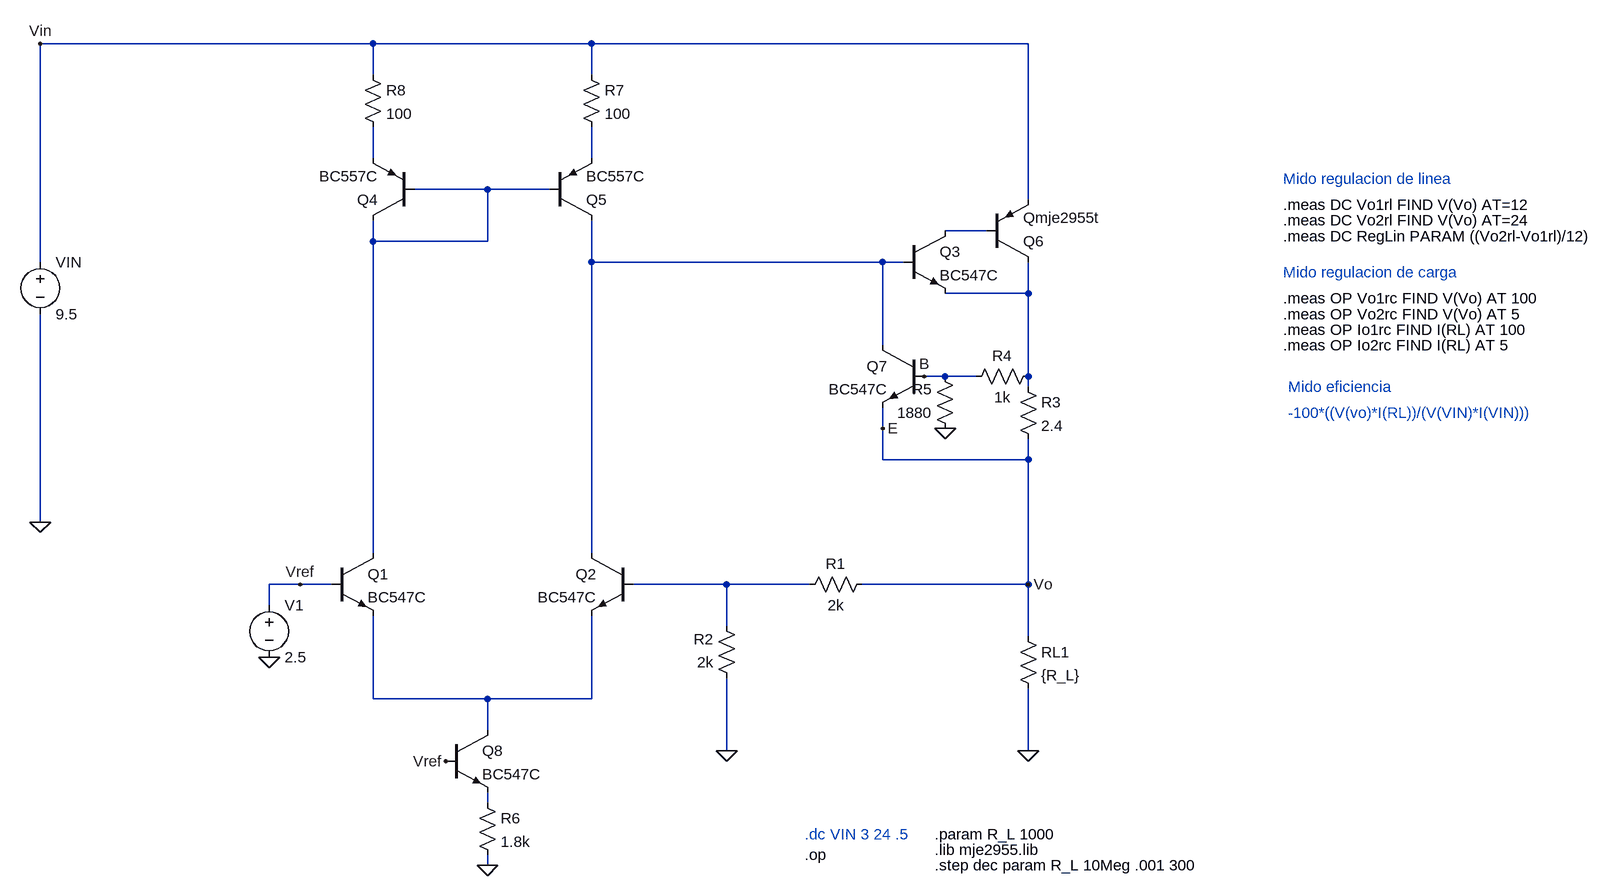
[diagram p0: schematic Draft3.asc]
Draft3.asc, the LTspice schematic file:
Version 4.1
SHEET 1 1356 680
WIRE -560 -688 -1072 -688
WIRE -224 -688 -560 -688
WIRE 448 -688 -224 -688
WIRE -560 -640 -560 -688
WIRE -224 -640 -224 -688
WIRE -560 -512 -560 -560
WIRE -224 -512 -224 -560
WIRE -384 -464 -496 -464
WIRE -288 -464 -384 -464
WIRE 448 -448 448 -688
WIRE 384 -400 320 -400
WIRE -560 -384 -560 -416
WIRE -384 -384 -384 -464
WIRE -384 -384 -560 -384
WIRE -1072 -352 -1072 -688
WIRE -224 -352 -224 -416
WIRE 224 -352 -224 -352
WIRE 256 -352 224 -352
WIRE 448 -304 448 -352
WIRE 448 -304 320 -304
WIRE 224 -224 224 -352
WIRE 320 -176 288 -176
WIRE 368 -176 320 -176
WIRE 448 -176 448 -304
WIRE 448 -160 448 -176
WIRE 224 -96 224 -128
WIRE 224 -48 224 -96
WIRE 448 -48 448 -80
WIRE 448 -48 224 -48
WIRE -1072 48 -1072 -272
WIRE -560 96 -560 -384
WIRE -224 96 -224 -352
WIRE -672 144 -720 144
WIRE -624 144 -672 144
WIRE -16 144 -160 144
WIRE 112 144 -16 144
WIRE 448 144 448 -48
WIRE 448 144 192 144
WIRE -720 176 -720 144
WIRE -16 208 -16 144
WIRE 448 224 448 144
WIRE -560 320 -560 192
WIRE -384 320 -560 320
WIRE -224 320 -224 192
WIRE -224 320 -384 320
WIRE -384 368 -384 320
WIRE -16 400 -16 288
WIRE 448 400 448 304
WIRE -384 480 -384 464
WIRE -384 576 -384 560
FLAG -720 256 0
FLAG 448 400 0
FLAG -1072 48 0
FLAG -16 400 0
FLAG 448 144 Vo
FLAG 320 -96 0
FLAG 288 -176 B
FLAG 224 -96 E
FLAG -672 144 Vref
FLAG -448 416 Vref
FLAG -384 576 0
FLAG -1072 -688 Vin
SYMBOL npn -624 96 R0
SYMATTR InstName Q1
SYMATTR Value BC547C
SYMBOL npn -160 96 M0
SYMATTR InstName Q2
SYMATTR Value BC547C
SYMBOL npn 256 -400 R0
SYMATTR InstName Q3
SYMATTR Value BC547C
SYMBOL pnp -496 -416 R180
SYMATTR InstName Q4
SYMATTR Value BC557C
SYMBOL pnp -288 -416 M180
SYMATTR InstName Q5
SYMATTR Value BC557C
SYMBOL voltage -720 160 R0
WINDOW 123 0 0 Left 0
WINDOW 39 0 0 Left 0
SYMATTR InstName V1
SYMATTR Value 2.5
SYMBOL voltage -1072 -368 R0
WINDOW 123 0 0 Left 0
WINDOW 39 0 0 Left 0
SYMATTR InstName VIN
SYMATTR Value 9.5
SYMBOL pnp 384 -352 M180
SYMATTR InstName Q6
SYMATTR Value Qmje2955t
SYMBOL res 432 208 R0
SYMATTR InstName RL1
SYMATTR Value {R_L}
SYMBOL res 208 128 R90
WINDOW 0 0 56 VBottom 2
WINDOW 3 32 56 VTop 2
SYMATTR InstName R1
SYMATTR Value 2k
SYMBOL res 0 304 R180
WINDOW 0 36 76 Left 2
WINDOW 3 36 40 Left 2
SYMATTR InstName R2
SYMATTR Value 2k
SYMBOL npn 288 -224 M0
SYMATTR InstName Q7
SYMATTR Value BC547C
SYMBOL res 432 -176 R0
SYMATTR InstName R3
SYMATTR Value 2.4
SYMBOL res 464 -192 R90
WINDOW 0 0 56 VBottom 2
WINDOW 3 32 56 VTop 2
SYMATTR InstName R4
SYMATTR Value 1k
SYMBOL res 336 -80 R180
WINDOW 0 36 76 Left 2
WINDOW 3 36 40 Left 2
SYMATTR InstName R5
SYMATTR Value 1880
SYMBOL npn -448 368 R0
SYMATTR InstName Q8
SYMATTR Value BC547C
SYMBOL res -400 464 R0
SYMATTR InstName R6
SYMATTR Value 1.8k
SYMBOL res -240 -656 R0
SYMATTR InstName R7
SYMATTR Value 100
SYMBOL res -576 -656 R0
SYMATTR InstName R8
SYMATTR Value 100
TEXT 304 528 Left 2 !.param R_L 1000
TEXT 304 552 Left 2 !.lib mje2955.lib
TEXT 104 528 Left 2 ;.dc VIN 3 24 .5
TEXT 304 576 Left 2 !.step dec param R_L 10Meg .001 300
TEXT 104 560 Left 2 !.op
TEXT 840 -480 Left 2 ;Mido regulacion de linea
TEXT 840 -440 Left 2 !.meas DC Vo1rl FIND V(Vo) AT=12
TEXT 840 -416 Left 2 !.meas DC Vo2rl FIND V(Vo) AT=24
TEXT 840 -392 Left 2 !.meas DC RegLin PARAM ((Vo2rl-Vo1rl)/12)
TEXT 840 -336 Left 2 ;Mido regulacion de carga
TEXT 840 -296 Left 2 !.meas OP Vo1rc FIND V(Vo) AT 100
TEXT 840 -272 Left 2 !.meas OP Vo2rc FIND V(Vo) AT 5
TEXT 840 -248 Left 2 !.meas OP Io1rc FIND I(RL) AT 100
TEXT 840 -224 Left 2 !.meas OP Io2rc FIND I(RL) AT 5
TEXT 848 -160 Left 2 ;Mido eficiencia
TEXT 848 -120 Left 2 ;-100*((V(vo)*I(RL))/(V(VIN)*I(VIN)))

The netlist it stands for:
* Draft3.asc
Q1 N003 Vref N008 0 BC547C
Q2 N005 N007 N008 0 BC547C
Q3 N004 N005 N006 0 BC547C
Q4 N003 N003 N001 0 BC557C
Q5 N005 N003 N002 0 BC557C
V1 Vref 0 2.5
VIN Vin 0 9.5
Q6 N006 N004 Vin 0 Qmje2955t
RL1 E 0 {R_L}
R1 E N007 2k
R2 0 N007 2k
Q7 N005 B E 0 BC547C
R3 N006 E 2.4
R4 N006 B 1k
R5 0 B 1880
Q8 N008 Vref N009 0 BC547C
R6 N009 0 1.8k
R7 Vin N002 100
R8 Vin N001 100
.model NPN NPN
.model PNP PNP
.lib standard.bjt
.param R_L 1000
.lib mje2955.lib
* .dc VIN 3 24 .5
.step dec param R_L 10Meg .001 300
.op
* Mido regulacion de linea
.meas DC Vo1rl FIND V(Vo) AT=12
.meas DC Vo2rl FIND V(Vo) AT=24
.meas DC RegLin PARAM ((Vo2rl-Vo1rl)/12)
* Mido regulacion de carga
.meas OP Vo1rc FIND V(Vo) AT 100
.meas OP Vo2rc FIND V(Vo) AT 5
.meas OP Io1rc FIND I(RL) AT 100
.meas OP Io2rc FIND I(RL) AT 5
* Mido eficiencia
* -100*((V(vo)*I(RL))/(V(VIN)*I(VIN)))
.backanno
.end